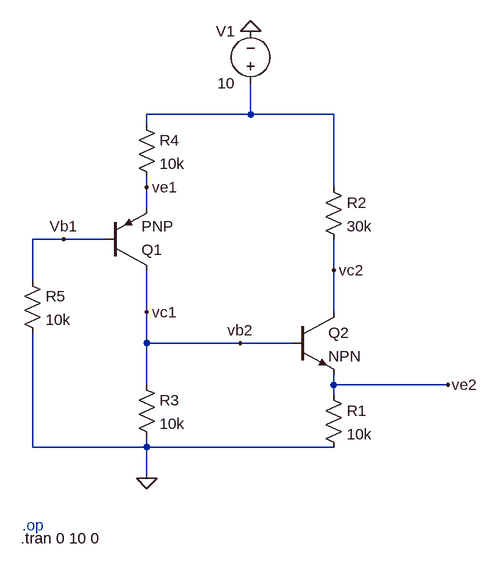
[diagram p0: schematic treinoaval.asc]
treinoaval.asc, the LTspice schematic file:
Version 4
SHEET 1 880 680
WIRE 192 -48 192 -96
WIRE 192 -48 32 -48
WIRE 320 -48 192 -48
WIRE 32 -32 32 -48
WIRE 32 64 32 48
WIRE 320 64 320 -48
WIRE 32 96 32 64
WIRE -96 144 -144 144
WIRE -32 144 -96 144
WIRE 320 192 320 144
WIRE -144 208 -144 144
WIRE 32 256 32 192
WIRE 320 256 320 192
WIRE 32 304 32 256
WIRE 176 304 32 304
WIRE 256 304 176 304
WIRE 32 368 32 304
WIRE 320 368 320 352
WIRE 496 368 320 368
WIRE 320 384 320 368
WIRE -144 464 -144 288
WIRE 32 464 32 448
WIRE 32 464 -144 464
WIRE 320 464 32 464
WIRE 32 512 32 464
FLAG 192 -176 0
FLAG 32 512 0
FLAG -96 144 Vb1
FLAG 176 304 vb2
FLAG 32 64 ve1
FLAG 32 256 vc1
FLAG 320 192 vc2
FLAG 496 368 ve2
SYMBOL pnp -32 192 M180
SYMATTR InstName Q1
SYMBOL npn 256 256 R0
SYMATTR InstName Q2
SYMBOL res 16 352 R0
SYMATTR InstName R3
SYMATTR Value 10k
SYMBOL res -160 192 R0
SYMATTR InstName R5
SYMATTR Value 10k
SYMBOL res 304 48 R0
SYMATTR InstName R2
SYMATTR Value 30k
SYMBOL voltage 192 -80 R180
WINDOW 0 24 96 Left 2
WINDOW 3 24 16 Left 2
WINDOW 123 0 0 Left 0
WINDOW 39 0 0 Left 0
SYMATTR InstName V1
SYMATTR Value 10
SYMBOL res 304 368 R0
SYMATTR InstName R1
SYMATTR Value 10k
SYMBOL res 16 -48 R0
SYMATTR InstName R4
SYMATTR Value 10k
TEXT -160 584 Left 2 ;.op
TEXT -162 604 Left 2 !.tran 0 10 0

The netlist it stands for:
* treinoaval.asc
Q1 vc1 Vb1 ve1 0 PNP
Q2 vc2 vc1 ve2 0 NPN
R3 vc1 0 10k
R5 Vb1 0 10k
R2 N001 vc2 30k
V1 N001 0 10
R1 ve2 0 10k
R4 N001 ve1 10k
.model NPN NPN
.model PNP PNP
.lib standard.bjt
* .op
.tran 0 10 0
.backanno
.end